# Altium project Automatic Water Level Controller.PrjPcb
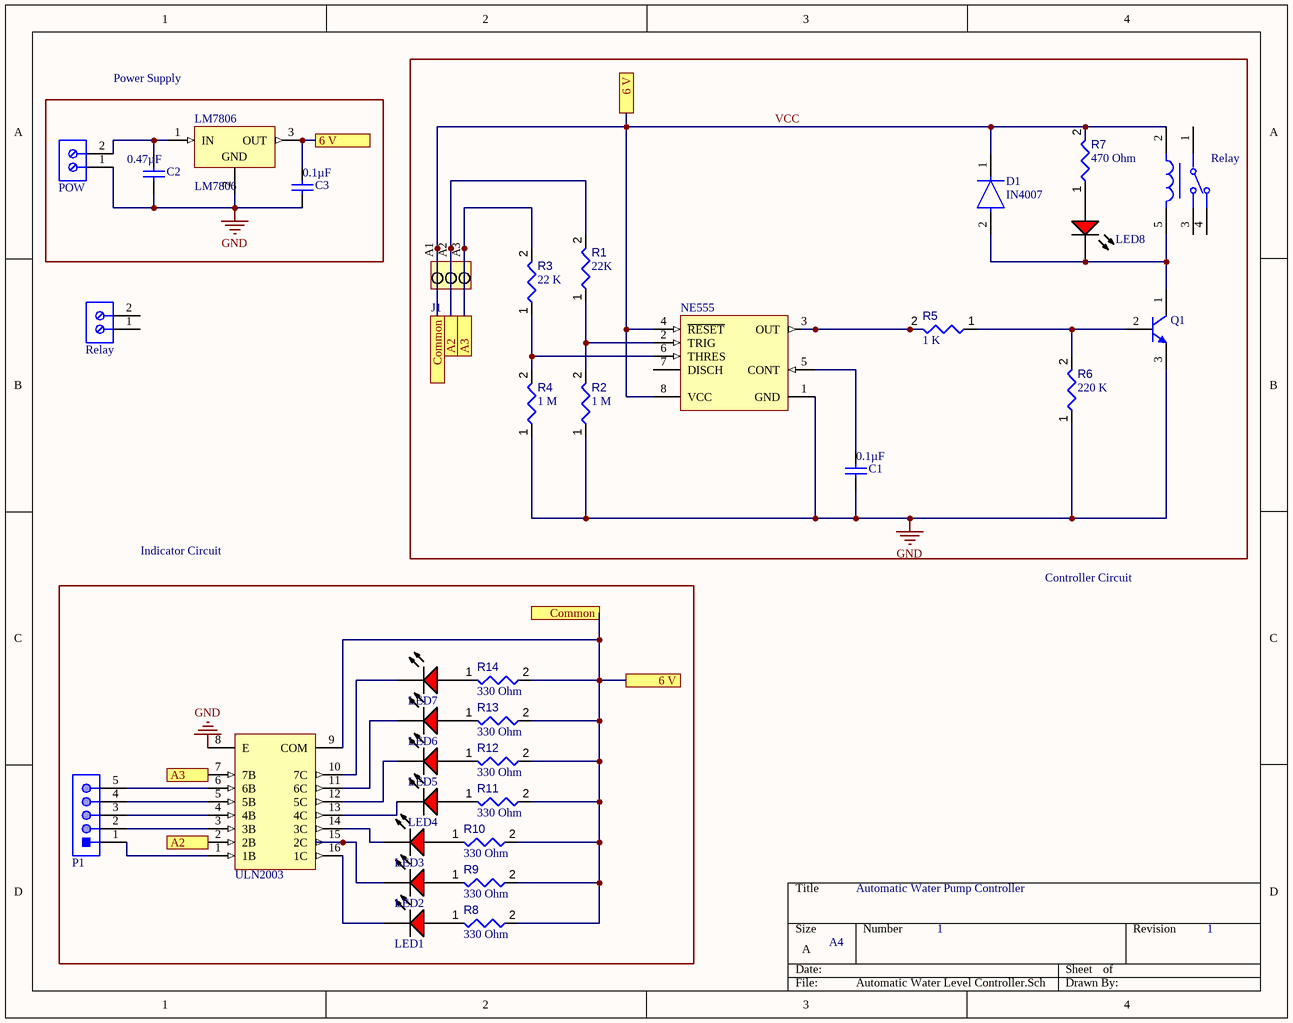
[diagram p0: Automatic Water Level Controller.SchDoc]
1 sheet, 35 parts. Net scope: flat (ports and power ports of the same name join across sheets).
Board file: Automatic Water Pump Controller.PcbDoc

## Sheet Automatic Water Level Controller.SchDoc
size A; SheetNumber: 1; SheetTotal: 1

### Parts
(Parts that share a designator on the sheet are numbered #1, #2 ... from top to bottom, then left to right.)
C1  Capacitance: 0.1µF  [VISH-K104K15X7RF5TL2]  (hidden comment: K104K15X7RF5TL2)
C2  Capacitance: 0.47µF  [KEMT-C330C105M5U5TA]  (hidden comment: C330C105M5U5TA)
C3  Capacitance: 0.1µF  [KEMT-C330C105M5U5TA]  (hidden comment: C330C105M5U5TA)
D1  IN4007  [FP-1N4007-MFG]
J1  1715320000  [LM_5_00_90_03]  (value not drawn)
LED1  HLMP-3301  [AVAG-HLMP-3301-2]  (value not drawn)
LED2  HLMP-3301  [AVAG-HLMP-3301-2]  (value not drawn)
LED3  HLMP-3301  [AVAG-HLMP-3301-2]  (value not drawn)
LED4  HLMP-3301  [AVAG-HLMP-3301-2]  (value not drawn)
LED5  HLMP-3301  [AVAG-HLMP-3301-2]  (value not drawn)
LED6  HLMP-3301  [AVAG-HLMP-3301-2]  (value not drawn)
LED7  HLMP-3301  [AVAG-HLMP-3301-2]  (value not drawn)
LED8  HLMP-3301  [AVAG-HLMP-3301-2]  (value not drawn)
LM7806  LM7806  [FAIR-TO-220-3]
NE555  NE555  [P0008A]  (value not drawn)
P1  691311700105  [691311700105]  (value not drawn)
POW  691102710002  [691102710002]  (value not drawn)
Q1  BC547BRL1G  [ONSC-TO-92-3-29-11_AM_BL]  (value not drawn)
R1  value 22K  [RESA60-630X240]  (hidden comment: MFR-25FBF52-475K)
R2  value 1 M  [RESA60-630X240]  (hidden comment: MFR-25FBF52-475K)
R3  value 22 K  [RESA60-630X240]  (hidden comment: MFR-25FBF52-475K)
R4  value 1 M  [RESA60-630X240]  (hidden comment: MFR-25FBF52-475K)
R5  value 1 K  [RESA60-630X240]  (hidden comment: MFR-25FBF52-475K)
R6  value 220 K  [RESA60-630X240]  (hidden comment: MFR-25FBF52-475K)
R7  value 470 Ohm  [RESA60-630X240]  (hidden comment: MFR-25FBF52-475K)
R8  value 330 Ohm  [RESA60-630X240]  (hidden comment: MFR-25FBF52-475K)
R9  value 330 Ohm  [RESA60-630X240]  (hidden comment: MFR-25FBF52-475K)
R10  value 330 Ohm  [RESA60-630X240]  (hidden comment: MFR-25FBF52-475K)
R11  value 330 Ohm  [RESA60-630X240]  (hidden comment: MFR-25FBF52-475K)
R12  value 330 Ohm  [RESA60-630X240]  (hidden comment: MFR-25FBF52-475K)
R13  value 330 Ohm  [RESA60-630X240]  (hidden comment: MFR-25FBF52-475K)
R14  value 330 Ohm  [RESA60-630X240]  (hidden comment: MFR-25FBF52-475K)
Relay#1  G5LE-14-DC5  [FP-G5LE-14-DC5-MFG]  (value not drawn)
Relay#2  691102710002  [691102710002]  (value not drawn)
ULN2003  ULN2003AN  [N0016A]  (value not drawn)

### Blocks framed on the sheet
Power Supply: C2 C3 LM7806 POW

### Ports
6 V (see Automatic Water Level Controller[1A], Automatic Water Level Controller[2A]), 6 V (see Automatic Water Level Controller[1A], Automatic Water Level Controller[2C]), 6 V (see Automatic Water Level Controller[2A], Automatic Water Level Controller[2C]), A2 (see Automatic Water Level Controller[1D]), A2 (see Automatic Water Level Controller[2B]), A3 (see Automatic Water Level Controller[1D]), A3 (see Automatic Water Level Controller[2B]), Common (see Automatic Water Level Controller[2B]), Common (see Automatic Water Level Controller[2C])

### Nets
GND: C1.1 C2.1 C3.1 LM7806.2(GND) NE555.1(GND) POW.1 Q1.3(E) R2.1 R4.1 R6.1 ULN2003.8(E)
VCC: C3.2 D1.1(C) J1.A1 LM7806.3(OUT) NE555.4(~{RESET}) NE555.8(VCC) R7.2 R8.2 R9.2 R10.2 R11.2 R12.2 R13.2 R14.2 Relay#1.2 ULN2003.9(COM) ; port 6 V, port Common
NetC1_2: C1.2 NE555.5(CONT)
NetC2_2: C2.2 LM7806.1(IN) POW.2
NetD1_2: D1.2(A) LED8.1(K) Q1.1(C) Relay#1.5
NetJ1_A2: J1.A2 R1.2 ULN2003.2(2B) ; port A2
NetJ1_A3: J1.A3 R3.2 ULN2003.7(7B) ; port A3
NetLED1_1: LED1.1(K) ULN2003.16(1C)
NetLED1_2: LED1.2(A) R8.1
NetLED2_1: LED2.1(K) ULN2003.15(2C)
NetLED2_2: LED2.2(A) R9.1
NetLED3_1: LED3.1(K) ULN2003.14(3C)
NetLED3_2: LED3.2(A) R10.1
NetLED4_1: LED4.1(K) ULN2003.13(4C)
NetLED4_2: LED4.2(A) R11.1
NetLED5_1: LED5.1(K) ULN2003.12(5C)
NetLED5_2: LED5.2(A) R12.1
NetLED6_1: LED6.1(K) ULN2003.11(6C)
NetLED6_2: LED6.2(A) R13.1
NetLED7_1: LED7.1(K) ULN2003.10(7C)
NetLED7_2: LED7.2(A) R14.1
NetLED8_2: LED8.2(A) R7.1
NetNE555_2: NE555.2(TRIG) R1.1 R2.2
NetNE555_3: NE555.3(OUT) R5.2
NetNE555_6: NE555.6(THRES) R3.1 R4.2
NetP1_1: P1.1 ULN2003.1(1B)
NetP1_2: P1.2 ULN2003.3(3B)
NetP1_3: P1.3 ULN2003.4(4B)
NetP1_4: P1.4 ULN2003.5(5B)
NetP1_5: P1.5 ULN2003.6(6B)
NetQ1_2: Q1.2(B) R5.1 R6.2

Not connected (* = marked no-connect by the designer): NE555 7(DISCH); Relay#1 1 3 4; Relay#2 1 2

### Notes on the sheet
- Indicator Circuit
- Controller Circuit
- Automatic Water Pump Controller
- A4
- 1

### Library data of the parts
C1 = CMP-2000-06508-1: Ceramic Capacitor, 100 nF, +/- 10%, 50 V, -55 to 125 degC, 2-Pin THD, RoHS, Tape and Reel; Manufacturer: Vishay; Other Names: BC1084CT; Catalog Drawings: Mono-KapSide2-15_5.58Mono-KapSide1_15; Temperature Coefficient: X7R; Voltage - Rated: 50V; Online Catalog: Mono-Kap™Series; Size / Dimension: 0.157"Lx0.098"W(4.00mmx2.50mm); Operating Temperature: -55°C~125°C; Family: CeramicCapacitors; Manufacturer URL: http://www.vishay.com/; Standard Package: 1; Thickness (Max): -; Ratings: -; Datasheet Version: 08/2013; Package Description: 2-Pin Through Hole Device, Body 4 x 2.6 mm; Mounting Type: ThroughHole; Features: -; Lead Spacing: 0.098"(2.50mm); Tolerance: ±10%; Category: Capacitors; Mounting Technology: ThroughHole; Lead Style: Straight; Datasheet URL: http://www.vishay.com/docs/45171/kseries.pdf; Applications: GeneralPurpose; Package / Case: Radial; Height - Seated (Max): 0.220"(5.58mm); Package Reference: K104K15X7RF5TL2; Series: Mono-Kap™K; Packaging: CutTape(CT)
C2 C3 = CMP-2000-06056-1: Ceramic Capacitor, 1 uF, +/- 20%, 50 V, -10 to 85 degC, 2-Pin THD, RoHS, Bulk; Manufacturer: Kemet; Voltage - Rated: 50V; Temperature Coefficient: Z5U; Catalog Drawings: C330(std); Product Training Modules: CapacitorBasics-TypicalUsesforCapacitors; Online Catalog: GoldenMax™Series; Other Names: 399-4390; PCN Design/Specification: C3yySeriesGoldenMaxLeadConfiguration02/Feb/2015; Thickness (Max): -; Size / Dimension: 0.300"Lx0.150"W(7.62mmx3.81mm); Mounting Technology: ThroughHole; Tolerance: ±20%; Mounting Type: ThroughHole; Datasheet URL: http://www.kemet.com/Lists/ProductCatalog/Attachments/599/KEM_C1051_GOLDMAX_Z5U.pdf; Series: GoldenMax™; Standard Package: 250; Ratings: -; Applications: GeneralPurpose; Package Reference: C330C105M5U5TA; Packaging: Bulk; Category: Capacitors; Package Description: 2-Pin Through Hole Device, Body 7.11 x 4.07 mm; Operating Temperature: 10°C~85°C; Height - Seated (Max): 0.360"(9.14mm); Manufacturer URL: http://www.kemet.com/; Lead Spacing: 0.200"(5.08mm); Features: -; Lead Style: Straight; Package / Case: Radial; Family: CeramicCapacitors; Datasheet Version: 12/2015
D1 = CMP-02540-000046-1: DIODE GEN PURP 1KV 1A DO204AL; Manufacturer: Vishay; Manufacturer Part Number: 1N4007-E3/54; Value: 15pF; Max Junction Temp: +150°C; Max Surge Forward Current: 30A; Max Repetitive Reverse Voltage: 1000V; Peak Reverse Current: 30uA; Octopart: https://octopart.com/1n4007-e3%2F54-vishay-39548207; Digikey Description: DIODE GEN PURP 1KV 1A DO204AL; Category: Diode; Mouser Description: Rectifiers Vr/1000V Io/1A; Automotive: No; Package: 1N4007; Device Class L3: Rectifier Diodes; Temperature Range High: +150°C; Capacitance: 15pF; Ipc Land Pattern Name: DIOPA1088W105L520D270; Lead Free: Yes; ComponentLink2Description: Datasheet; Forward Current: 1A; Device Class L1: Discrete Semiconductors; ComponentLink2URL: http://www.vishay.com/docs/88503/1n4001.pdf; Temperature Range Low: -50°C; Height: 2.7mm; RoHS: TRUE; Temperature: -50°C to +150°C; Device Class L2: Diodes
J1 = CMP-1559-01747-1: OMNIMATE Signal - series LM; Manufacturer: Weidmueller; UL_94_flammability_rating: V-0; Solid_min_H05_07_V_U: 0,2 mm²; Mounting_onto_the_PCB: Solder connection; Wire_cross_section_AWG_min_UL_1059: AWG 24; Contact_material: Cu-Leg; Wire_cross_section_AWG_max_UL_1059: AWG 14; Rated_voltage_for_surge_voltage_class_pollution_degree_II_2: 630 V; No_of_poles: 3; Short_text_for_material: LM 5.00/03/90 3.5SN OR BX; Solid_max_H05_07_V_U: 2,5 mm²; Insulating_material: Wemid (PA); Rated_current_use_group_B_UL_1059: 15 A; Rated_voltage_use_group_B_UL_1059: 300 V; Contact_surface: tinned; Pitch_inch: 0,197 inch; Pitch_mm: 5 mm; Side_termination_characteristic: closed side; Solder_pin_length_mm: 3,5 mm; Packaging: Box; Revision: V1; ComponentLink2URL: http://catalog.weidmueller.com/catalog/Start.do?localeId=en&ObjectID=1715320000; ComponentLink1URL: http://www.weidmueller.com/; ComponentLink2Description: URL Link1; PartNumber: 1715320000; PackageReference: LM_5_00_90_03; ComponentLink1Description: Manufacturer URL; Colour: Orange; Qty: 500 PCS
LED1-LED8 = CMP-2000-06411-1: T-1 3/4 (5 mm) Diffused LED Lamp, 1.9 V, -40 to 100 degC, 2-Pin THD, RoHS, Bulk; Manufacturer: Avago; Forward Current: 25mA; Forward Voltage: 2.4V; Peak Wavelength: 635nm; Shape Type: Circular; High Brightness: No; Main Category: StandardLED; Test Current (It): 10mA; Dominant Wave Length: 626nm; Number of  Elements: 1; Reverse Voltage: 5V; Chip Material: GaP; Product Height (mm): 9.19mm; Lens Type: ColoredDiffused; Viewing Angle: 60deg; Type: Uni-Color; Emitting Color: Red; Luminous Intensity: 5.4mcd; Power Dissipation: 85W; DELETED: Compliant; Product Depth (mm): 6.1mm; Package Description: 2-Pin Through Hole LED, Dia 5.85 mm; Mounting Technology: ThroughHole; Manufacturer URL: http://www.avagotech.com/; Package Type: T-13/4; Operating Temp Range: -40Cto100C; Datasheet URL: http://www.avagotech.com/docs/AV02-1558EN; Mounting: ThroughHole; Lens Dimensions: 5.08x5.08x8.3mm; Package Reference: HLMP-3301; Datasheet Version: 03/2015; Pin Count: 2; Packaging: TapeandReel; Operating Temperature Classification: Industrial; Lum Intensity: 5.4mcd; Rad Hardened: No; Product Length (mm): 6.1mm
LM7806 = CMP-2000-04938-1: Positive Voltage Regulator, 5 V, 1 A, -40 to 125 degC, 3-Pin TO-220, RoHS, Tube; Manufacturer: FairchildSemiconductor; Maximum Input Voltage: 35V; Maximum Quiescent Current: 8mA; Load Regulation: 100mV; Maximum Output Current: 2.2(Typ)A; Output Type: Fixed; Typical Dropout Voltage @ Current: 2@1AV; Rad Hard: No; Output Voltage: 5V; Accuracy: ±4%; Number of Outputs: 1; Category: LinearRegulator; Package Description: 3-Pin Through Hole Device, Body 10 x 4.5 mm, Pitch 2.54 mm; Packaging: Rail/Tube; Mounting: ThroughHole; Polarity: Positive; Manufacturer URL: https://www.fairchildsemi.com/; Line Regulation: 100mV; Datasheet Version: Aug-12; Datasheet URL: https://datasheet.ciiva.com/26904/lm7805ct-26904988.pdf; Package Reference: TO-220; Package URL: https://www.fairchildsemi.com/package-drawings/TO/TO220B03.pdf; Package: 3TO-220AB; Operating Temperature: -40to125degC; Type: Linear
NE555 = CMP-2000-04954-1: Precision Timer, 4.5 to 16 V, 0 to 70 degC, 8-Pin DIP, Pb-Free, Tube; Manufacturer: TexasInstruments; Maximum High Level Output Current: -200mA; Number of Internal Timers: 1; Operating Supply Voltage: 5; Maximum Low Level Output Current: 200mA; Rad Hard: No; Packaging: Rail/Tube; Manufacturer URL: http://www.ti.com/; Package Reference: P8; Package Description: 8-Pin Double In-line Package, Body 9.59 x 6.35 mm, Pitch 2.54 mm; Package URL: http://www.ti.com/lit/ml/mpdi001b/mpdi001b.pdf; Type: Standard; Datasheet URL: http://www.ti.com/general/docs/lit/getliterature.tsp?genericPartNumber=NE555&fileType=pdf; Category: Timer; Package: 8PDIP; Datasheet Version: Rev. I, 09/2014
P1 = CMP-1502-02036-1: Serie 3117 - 5.00mm Close Vertical PCB Header WR-TBL, 5 pin; Manufacturer: Wurth Elektronik; Pin Number: 5; Gender: Male; Operating Temperature: -40to105degC; Package Reference: 691311700105; Pitch: 5.00mm; Datasheet URL: http://katalog.we-online.de/em/datasheet/6913117001xx.pdf; Part Number: 691311700105; Publisher: WurthElektronik; Manufacturer URL: http://www.we-online.de; Packaging: Box; Mounting Technology: THT
POW Relay#2 = CMP-1502-03258-1: Series 102 - 5.00 mm Horizontal Entry Modular with Pressure Clamp WR-TBL, 2 pin; Manufacturer: Wurth Elektronik; Pin Number: 2; Pitch: 5.00mm; Manufacturer URL: http://www.we-online.de; Mounting Technology: THT; Publisher: WurthElektronik; Packaging: Box; Package Reference: 691102710002; Datasheet URL: http://katalog.we-online.de/em/datasheet/6911027100xx.pdf; Operating Temperature: -40to105degC; Part Number: 691102710002
Q1 = CMP-1048-01605-1: Amplifier Transistor, NPN Silicon, 3-Pin TO-92, Pb-Free, Tape and Reel; Manufacturer: On Semiconductor; IC Continuous (A): 0.1; fT Min (MHz): 150; ComponentLink2URL: http://www.onsemi.com/pub_link/Collateral/BC546-D.PDF; ComponentLink1URL: http://www.onsemi.com/; ComponentLink2Description: Datasheet; RoHS: TRUE; ComponentLink3Description: Package Specification; ComponentLink1Description: Manufacturer URL; ComponentLink3URL: http://www.onsemi.com/pub_link/Collateral/MAC97-D.PDF; PackageDescription: 3-Pin Transistor Outline, Body 4.825 x 3.685 mm, Pitch 1.27 mm; Packing: Tape and Reel; PackageVersion: Rev. AM; Polarity: NPN; DatasheetVersion: Rev. 7; Mounting Technology: Through Hole; PackageReference: TO-92-3-29-11_AM_BL; PartNumber: BC547BRL1G
R1-R14 = CMP-009-00055-4: Axial Resistor, 475 KOhm, +/- 1%, 0.25 W, -55 to 155 degC, 2-Pin THD, RoHS, Bulk; Manufacturer: Yageo; Power: 250mW; Voltage Rating: 250V; Case/Package: Axial; Mounting Technology: TH; RoHS Compliant: True; Package Description: 2-Pin Axial Lead, Dia 2.4 mm, Body Length 6.3 mm; Min Operating Temperature: -55°C; Datasheet URL: http://www.yageo.com/documents/recent/Yageo%20LR_MFR_2013.pdf; Manufacturer URL: http://www.yageo.com/; Package Quantity: 200; Package Reference: MFR-25; Max Operating Temperature: 155°C; Datasheet Version: Apr-13; Tolerance: 1%; Packaging: Bulk
Relay#1 = CMP-08822-000008-1: RELAY GEN PURPOSE SPDT 10A 5V; Manufacturer: Omron; Number Of Contacts: 1; Coil Type: Non-Latching; Coil Current: 79.4mA; Coil Power: 400mW; Coil Resistance: 63Ω; Standoff Height: 0.5mm; Throw Configuration: SPDT; Ambient Temperature Range Low: -25°C; Package: 0; Device Class L2: Relays; Temperature Range High: +85°C; ComponentLink2Description: Datasheet; Octopart: https://octopart.com/g5le-14-dc5-omron-28829; Coil Voltage: 5V; Lead Free: Yes; Digikey Description: RELAY GEN PURPOSE SPDT 10A 5V; Device Class L1: Electromechanical; Device Class L3: Power Relays; ComponentLink2URL: https://omronfs.omron.com/en_US/ecb/products/pdf/en-g5le.pdf; Temperature: -25°C to +85°C; Ambient Temperature Range High: +85°C; RoHS: TRUE; Automotive: No; Height: 19mm; Category: Relay; Manufacturer Part Number: G5LE-14-DC5; Mouser Description: General Purpose Relays Power PCB Relay SPDT Sealed 5VDC; Current Rating: 10A; Switching Current: 10A; Temperature Range Low: -25°C
ULN2003 = CMP-2000-07352-1: High-Voltage, High-Current Darlington Transistor Array, 50 V, 500 mA, -20 to 70 degC, 16-Pin PDIP (N), Pb-Free (RoHS), Tube; Manufacturer: TexasInstruments; Maximum Collector Emitter Saturation Voltage: 1.1@100mA; Peak DC Collector Current: 0.5A; Package Version: 4040049/E, 12/2002; Configuration: Array7; Maximum Collector Emitter Voltage: 50V; Rad Hard: No; Mounting: ThroughHole; Datasheet URL: http://www.ti.com/general/docs/lit/getliterature.tsp?genericPartNumber=uln2003a&fileType=pdf; Package: 16PDIP; Package Reference: N16; Datasheet Version: Rev. O, 01/2016; Mounting Technology: ThroughHole; Package Description: 16-Pin Plastic In-Line, Body 19.305 x 6.35 mm, Pitch 2.54 mm; Manufacturer URL: http://www.ti.com/; Type: NPN; Category: DarlingtonBJT; Package URL: http://www.ti.com/litv/pdf/mpdi002c; Packaging: Rail/Tube